# Altium schematic sheet K60最小系统.SchDoc
size A4
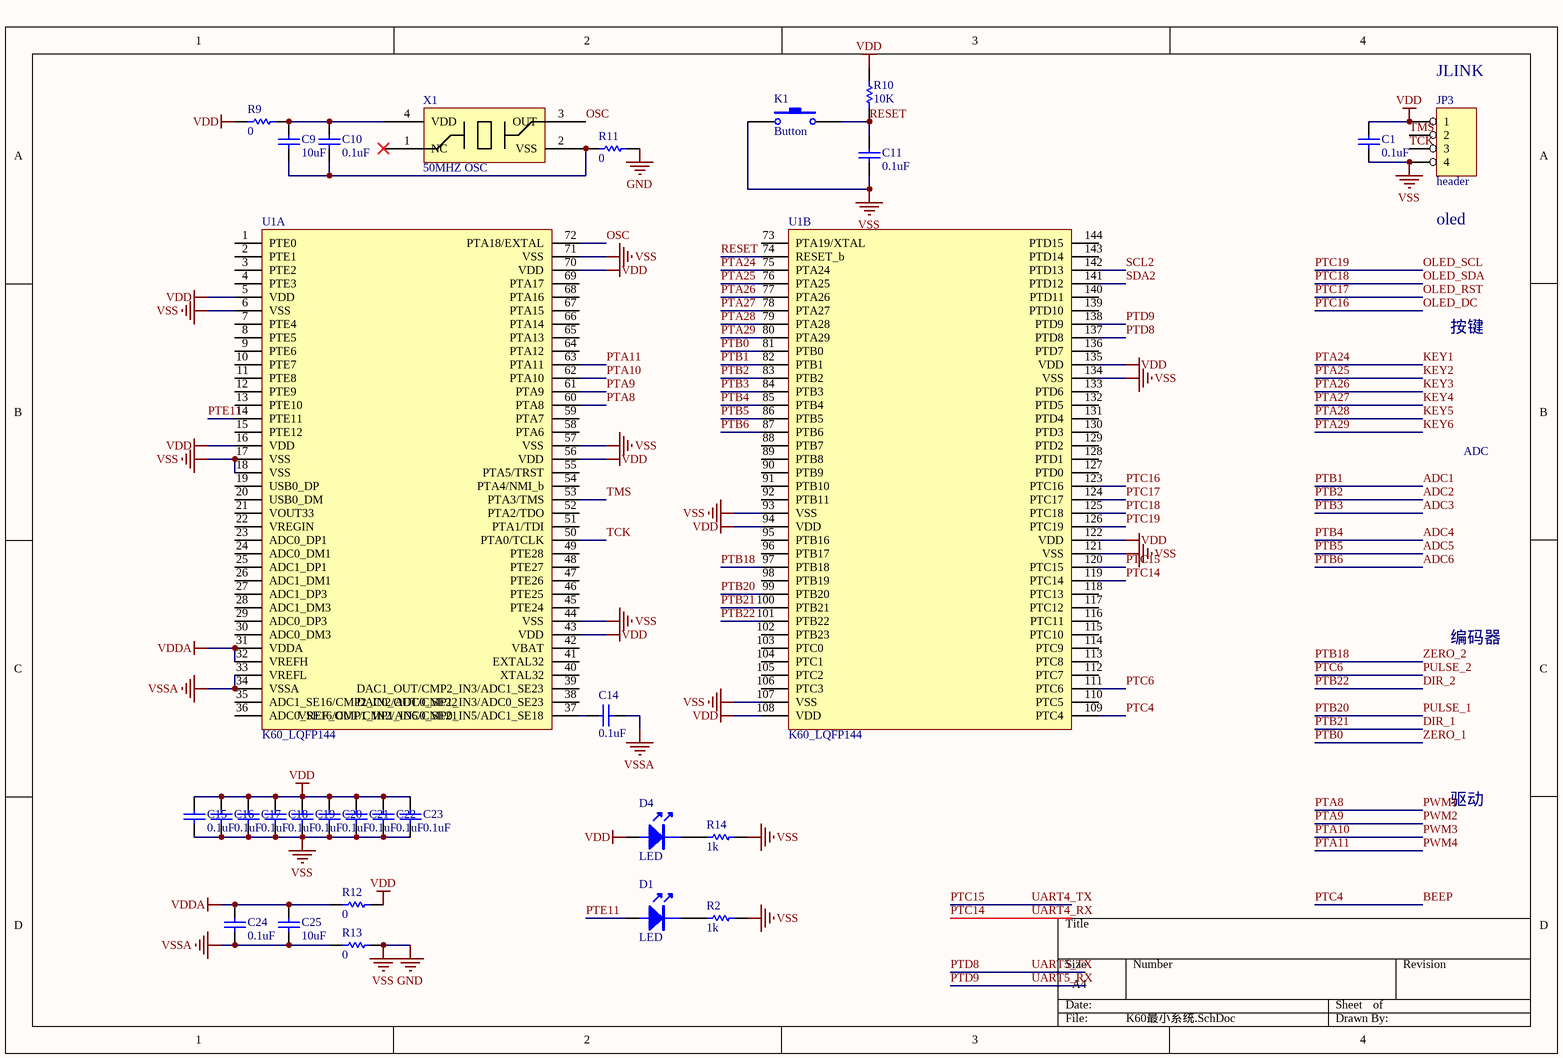
[diagram p0: K60最小系统.SchDoc]

## Parts
C1  0.1uF  [0603_C]
C9  10uF  [0603_C]
C10  0.1uF  [0603_C]
C11  0.1uF  [0603_C]
C14  0.1uF  [0603_C]
C15  0.1uF  [0603_C]
C16  0.1uF  [0603_C]
C17  0.1uF  [0603_C]
C18  0.1uF  [0603_C]
C19  0.1uF  [0603_C]
C20  0.1uF  [0603_C]
C21  0.1uF  [0603_C]
C22  0.1uF  [0603_C]
C23  0.1uF  [0603_C]
C24  0.1uF  [0603_C]
C25  10uF  [0603_C]
D1  LED  [0603_LED]
D4  LED  [0603_LED]
JP3  header  [header4_M]
K1  Button  [Button_4_4*4]
R2  1k  [R0603]
R9  0  [R0603]
R10  10K  [R0603]
R11  0  [R0603]
R12  0  [R0603]
R13  0  [R0603]
R14  1k  [R0603]
U1  K60_LQFP144  [LQFP144]  (parts A,B of 2)
X1  50MHZ OSC  [XTAL_5032]

## Nets
GND: C1.1 C11.1 C15.1 C16.1 C17.1 C18.1 C19.1 C20.1 C21.1 C22.1 C23.1 JP3.4 K1.1 R2.1 R11.1 R13.1 R14.1 U1.6(VSS) U1.17(VSS) U1.18(VSS) U1.44(VSS) U1.57(VSS) U1.71(VSS) U1.93(VSS) U1.107(VSS) U1.121(VSS) U1.134(VSS)  [also labelled VSS]
VDD: C1.2 C15.2 C16.2 C17.2 C18.2 C19.2 C20.2 C21.2 C22.2 C23.2 D4.1(A) JP3.1 R9.2 R10.2 R12.1 U1.5(VDD) U1.16(VDD) U1.43(VDD) U1.56(VDD) U1.70(VDD) U1.94(VDD) U1.108(VDD) U1.122(VDD) U1.135(VDD)
VDDA: C24.1 C25.2 R12.2 U1.31(VDDA) U1.32(VREFH)
VSSA: C14.1 C24.2 C25.1 R13.2 U1.33(VREFL) U1.34(VSSA)
ADC1: U1.82(PTB1)  [also labelled PTB1]
ADC2: U1.83(PTB2)  [also labelled PTB2]
ADC3: U1.84(PTB3)  [also labelled PTB3]
ADC4: U1.85(PTB4)  [also labelled PTB4]
ADC5: U1.86(PTB5)  [also labelled PTB5]
ADC6: U1.87(PTB6)  [also labelled PTB6]
BEEP: U1.109(PTC4)  [also labelled PTC4]
DIR_1: U1.100(PTB21)  [also labelled PTB21]
DIR_2: U1.101(PTB22)  [also labelled PTB22]
KEY1: U1.75(PTA24)  [also labelled PTA24]
KEY2: U1.76(PTA25)  [also labelled PTA25]
KEY3: U1.77(PTA26)  [also labelled PTA26]
KEY4: U1.78(PTA27)  [also labelled PTA27]
KEY5: U1.79(PTA28)  [also labelled PTA28]
KEY6: U1.80(PTA29)  [also labelled PTA29]
OLED_DC: U1.123(PTC16)  [also labelled PTC16]
OLED_RST: U1.124(PTC17)  [also labelled PTC17]
OLED_SCL: U1.126(PTC19)  [also labelled PTC19]
OLED_SDA: U1.125(PTC18)  [also labelled PTC18]
OSC: U1.72(PTA18/EXTAL) X1.3(OUT)
PTA8: U1.60(PTA8)  [also labelled PWM1]
PTA9: U1.61(PTA9)  [also labelled PWM2]
PTA10: U1.62(PTA10)  [also labelled PWM3]
PTA11: U1.63(PTA11)  [also labelled PWM4]
PTB0: U1.81(PTB0)  [also labelled ZERO_1]
PTB18: U1.97(PTB18)  [also labelled ZERO_2]
PTB20: U1.99(PTB20)  [also labelled PULSE_1]
PTC6: U1.111(PTC6)  [also labelled PULSE_2]
PTC14: U1.119(PTC14)  [also labelled UART4_RX]
PTC15: U1.120(PTC15)  [also labelled UART4_TX]
PTD8: U1.137(PTD8)  [also labelled UART5_TX]
PTD9: U1.138(PTD9)  [also labelled UART5_RX]
PTE11: D1.1(A) U1.14(PTE11)
RESET: C11.2 K1.2 R10.1 U1.74(RESET_b)
SCL2: U1.142(PTD13)
SDA2: U1.141(PTD12)
TCK: JP3.3 U1.50(PTA0/TCLK)
TMS: JP3.2 U1.53(PTA3/TMS)
NetC9_1: C9.1 C10.1 R11.2 X1.2(VSS)
NetC9_2: C9.2 C10.2 R9.1 X1.4(VDD)
NetC14_2: C14.2 U1.37(VREF_OUT/CMP1_IN5/CMP0_IN5/ADC1_SE18)
NetD1_2: D1.2(K) R2.2
NetD4_2: D4.2(K) R14.2

Not connected (* = marked no-connect by the designer): U1 1(PTE0) 2(PTE1) 3(PTE2) 4(PTE3) 7(PTE4) 8(PTE5) 9(PTE6) 10(PTE7) 11(PTE8) 12(PTE9) 13(PTE10) 15(PTE12) 19(USB0_DP) 20(USB0_DM) 21(VOUT33) 22(VREGIN) 23(ADC0_DP1) 24(ADC0_DM1) 25(ADC1_DP1) 26(ADC1_DM1) 27(ADC1_DP3) 28(ADC1_DM3) 29(ADC0_DP3) 30(ADC0_DM3) 35(ADC1_SE16/CMP2_IN2/ADC0_SE22) 36(ADC0_SE16/CMP1_IN2/ADC0_SE21) 38(DAC0_OUT/CMP1_IN3/ADC0_SE23) 39(DAC1_OUT/CMP2_IN3/ADC1_SE23) 40(XTAL32) 41(EXTAL32) 42(VBAT) 45(PTE24) 46(PTE25) 47(PTE26) 48(PTE27) 49(PTE28) 51(PTA1/TDI) 52(PTA2/TDO) 54(PTA4/NMI_b) 55(PTA5/TRST) 58(PTA6) 59(PTA7) 64(PTA12) 65(PTA13) 66(PTA14) 67(PTA15) 68(PTA16) 69(PTA17) 73(PTA19/XTAL) 88(PTB7) 89(PTB8) 90(PTB9) 91(PTB10) 92(PTB11) 95(PTB16) 96(PTB17) 98(PTB19) 102(PTB23) 103(PTC0) 104(PTC1) 105(PTC2) 106(PTC3) 110(PTC5) 112(PTC7) 113(PTC8) 114(PTC9) 115(PTC10) 116(PTC11) 117(PTC12) 118(PTC13) 127(PTD0) 128(PTD1) 129(PTD2) 130(PTD3) 131(PTD4) 132(PTD5) 133(PTD6) 136(PTD7) 139(PTD10) 140(PTD11) 143(PTD14) 144(PTD15); X1 1(NC)*

## Notes on the sheet
- (near JP3) JLINK
- (near JP3) oled
- 按键
- ADC
- 编码器
- 驱动

## Library data of the parts
C1 C9-C11 C14-C25 = CAP: Capacitor; Value: 104; Published: 8-Jun-2000; LatestRevisionDate: 17-Jul-2002; LatestRevisionNote: Re-released for DXP Platform.; PackageReference: RAD-0.3; Publisher: Altium Limited
D1 D4 = LED: LED 发光二极管
JP3 = HEADER 4
R2 R14 = RES: Resistor; Published: 8-Jun-2000; Revision: July-2002: Re-released for DXP Platform.; Publisher: Altium Limited; Value: 1K
R9-R13 = RES: Resistor; Value: 1K; Published: 8-Jun-2000; Revision: July-2002: Re-released for DXP Platform.; Publisher: Altium Limited
X1 = XTAL_贴片
K1 = Button: Published: 24-Mar-1999; LatestRevisionDate: 17-Jul-2002; LatestRevisionNote: Re-released for DXP Platform.; PackageReference: SPST-2; Publisher: Altium Limited